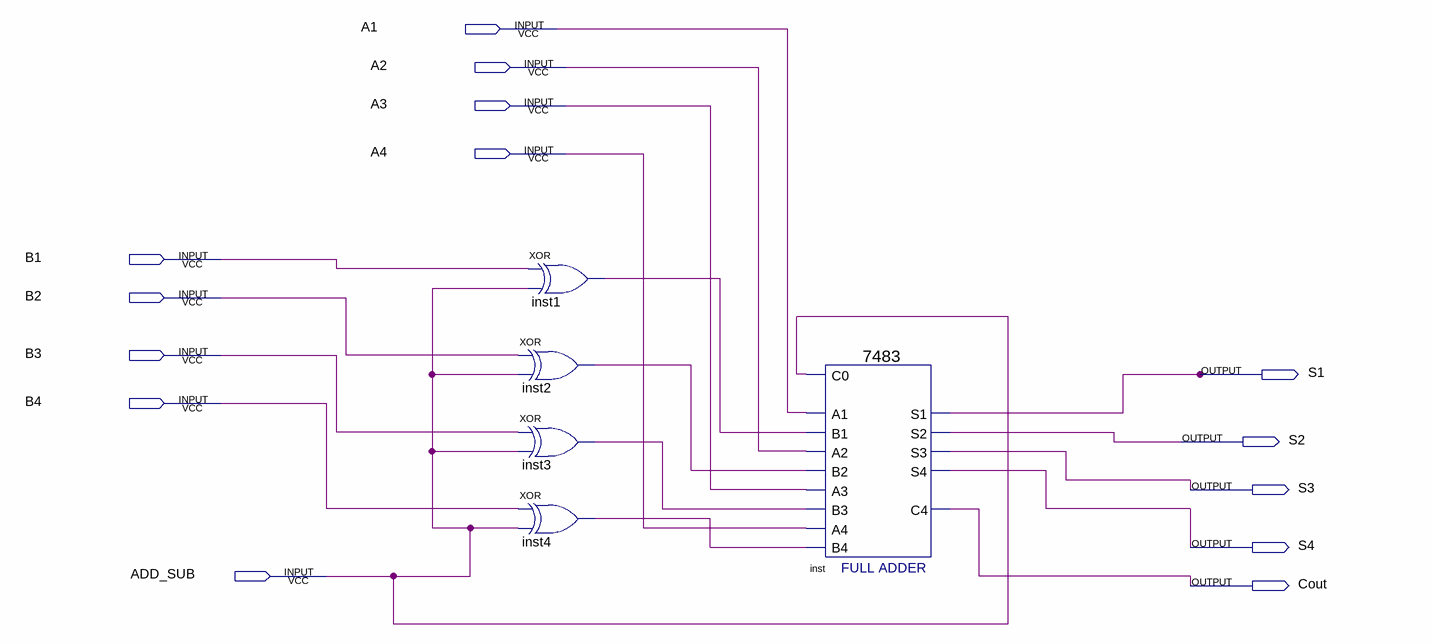
[diagram p0: schematic sheet]
// Quartus schematic add_sub_4.bdf as structural Verilog: 5 symbols, 14 pins
module add_sub_4 (
  input  A1,
  input  A2,
  input  A3,
  input  A4,
  input  B1,
  input  B2,
  input  B3,
  input  B4,
  input  ADD_SUB,
  output S1,
  output S2,
  output S3,
  output S4,
  output Cout
);

  wire inst1_out, inst2_out, inst3_out, inst4_out;

  xor inst2 (inst2_out, B2, ADD_SUB);
  xor inst3 (inst3_out, B3, ADD_SUB);
  xor inst4 (inst4_out, B4, ADD_SUB);
  xor inst1 (inst1_out, B1, ADD_SUB);
  \7483  inst (
    .B4(inst4_out), .C0(ADD_SUB), .A1(A1), .A2(A2), .B1(inst1_out), .B2(inst2_out), .A3(A3), .B3(inst3_out),
    .A4(A4), .S3(S3), .S4(S4), .S2(S2), .C4(Cout), .S1(S1));
endmodule
